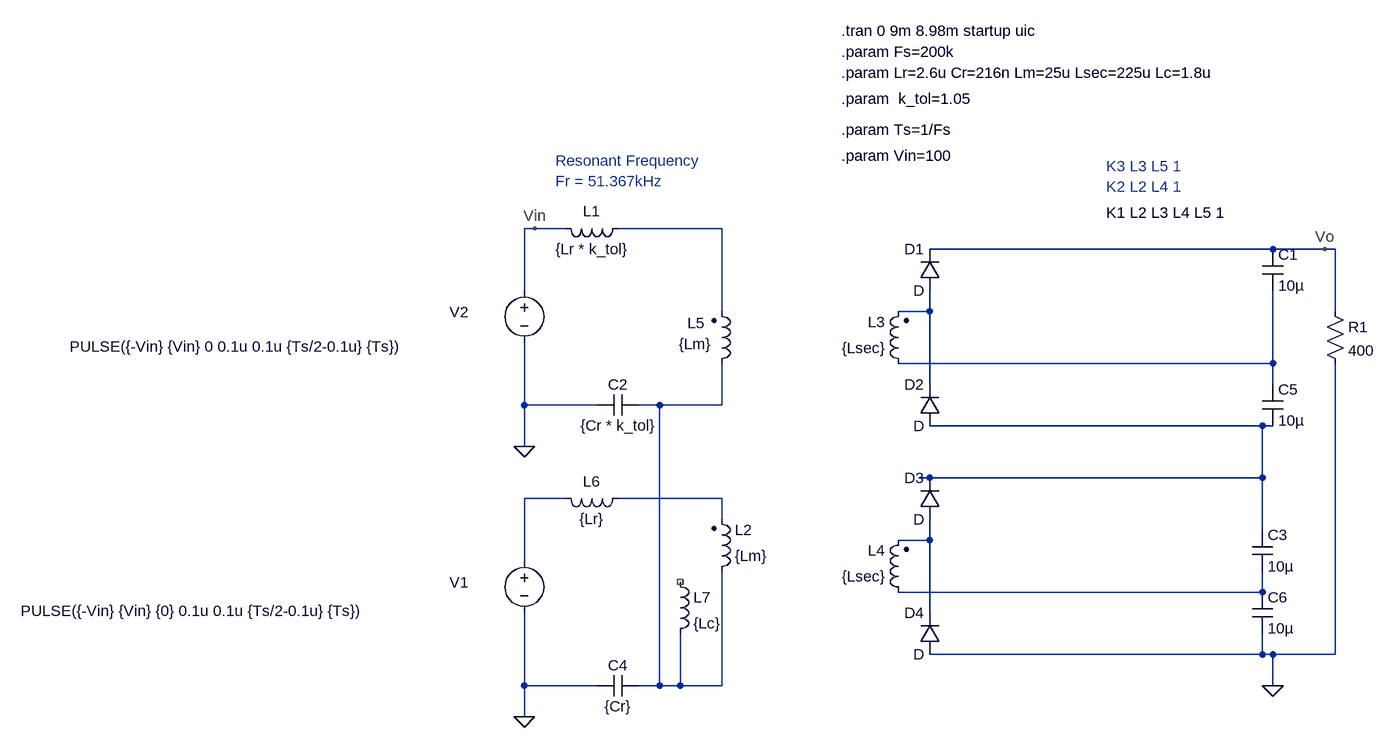
[diagram p0: schematic LLC 2-phase IPOS coupled transformer.asc]
LLC 2-phase IPOS coupled transformer.asc, the LTspice schematic file:
Version 4
SHEET 1 880 1140
WIRE -528 -96 -544 -96
WIRE -480 -96 -528 -96
WIRE -240 -96 -400 -96
WIRE 608 -64 80 -64
WIRE 688 -64 608 -64
WIRE 704 -64 688 -64
WIRE -544 0 -544 -96
WIRE -240 32 -240 -96
WIRE 80 32 80 0
WIRE 80 32 32 32
WIRE 704 32 704 -64
WIRE 608 112 608 0
WIRE 608 112 32 112
WIRE 80 144 80 32
WIRE 608 144 608 112
WIRE -544 176 -544 80
WIRE -432 176 -544 176
WIRE -336 176 -368 176
WIRE -240 176 -240 112
WIRE -240 176 -336 176
WIRE 592 208 80 208
WIRE 608 208 592 208
WIRE -544 240 -544 176
WIRE 80 288 64 288
WIRE 592 288 592 208
WIRE 592 288 80 288
WIRE -480 320 -544 320
WIRE -240 320 -400 320
WIRE -240 352 -240 320
WIRE 592 368 592 288
WIRE 80 384 80 352
WIRE 80 384 32 384
WIRE -544 416 -544 320
WIRE 592 464 592 432
WIRE 592 464 32 464
WIRE 80 496 80 384
WIRE 592 560 592 528
WIRE 592 560 80 560
WIRE 608 560 592 560
WIRE 704 560 704 112
WIRE 704 560 608 560
WIRE -544 608 -544 496
WIRE -432 608 -544 608
WIRE -336 608 -336 176
WIRE -336 608 -368 608
WIRE -304 608 -304 528
WIRE -304 608 -336 608
WIRE -240 608 -240 432
WIRE -240 608 -304 608
WIRE 608 608 608 560
WIRE -544 656 -544 608
FLAG 608 608 0
FLAG 688 -64 Vo
FLAG -544 240 0
FLAG -528 -96 Vin
FLAG -544 656 0
SYMBOL ind -496 -112 M90
WINDOW 0 5 56 VBottom 2
WINDOW 3 32 56 VTop 2
SYMATTR InstName L1
SYMATTR Value {Lr * k_tol}
SYMBOL ind2 -256 448 M180
WINDOW 0 36 80 Left 2
WINDOW 3 36 40 Left 2
SYMATTR InstName L2
SYMATTR Value {Lm}
SYMATTR Type ind
SYMBOL ind2 48 128 R180
WINDOW 0 36 80 Left 2
WINDOW 3 36 40 Left 2
SYMATTR InstName L3
SYMATTR Value {Lsec}
SYMATTR Type ind
SYMBOL diode 96 0 R180
WINDOW 0 24 64 Left 2
WINDOW 3 24 0 Left 2
SYMATTR InstName D1
SYMBOL res 688 16 R0
SYMATTR InstName R1
SYMATTR Value 400
SYMBOL diode 96 208 R180
WINDOW 0 24 64 Left 2
WINDOW 3 24 0 Left 2
SYMATTR InstName D2
SYMBOL cap -432 192 R270
WINDOW 0 32 32 VTop 2
WINDOW 3 0 32 VBottom 2
SYMATTR InstName C2
SYMATTR Value {Cr * k_tol}
SYMBOL cap 576 368 R0
SYMATTR InstName C3
SYMATTR Value 10µ
SYMBOL diode 96 352 R180
WINDOW 0 24 64 Left 2
WINDOW 3 24 0 Left 2
SYMATTR InstName D3
SYMBOL diode 96 560 R180
WINDOW 0 24 64 Left 2
WINDOW 3 24 0 Left 2
SYMATTR InstName D4
SYMBOL ind2 48 480 R180
WINDOW 0 36 80 Left 2
WINDOW 3 36 40 Left 2
SYMATTR InstName L4
SYMATTR Value {Lsec}
SYMATTR Type ind
SYMBOL ind2 -256 128 M180
WINDOW 0 -37 78 Left 2
WINDOW 3 -50 46 Left 2
SYMATTR InstName L5
SYMATTR Value {Lm}
SYMATTR Type ind
SYMBOL cap -432 624 R270
WINDOW 0 32 32 VTop 2
WINDOW 3 0 32 VBottom 2
SYMATTR InstName C4
SYMATTR Value {Cr}
SYMBOL voltage -544 -16 R0
WINDOW 123 0 0 Left 0
WINDOW 39 0 0 Left 0
WINDOW 3 -700 102 Left 2
WINDOW 0 -115 49 Left 2
SYMATTR Value PULSE({-Vin} {Vin} 0 0.1u 0.1u {Ts/2-0.1u} {Ts})
SYMATTR InstName V2
SYMBOL voltage -544 400 R0
WINDOW 123 0 0 Left 0
WINDOW 39 0 0 Left 0
WINDOW 3 -775 93 Left 2
WINDOW 0 -115 49 Left 2
SYMATTR Value PULSE({-Vin} {Vin} {0} 0.1u 0.1u {Ts/2-0.1u} {Ts})
SYMATTR InstName V1
SYMBOL ind -496 304 M90
WINDOW 0 5 56 VBottom 2
WINDOW 3 32 56 VTop 2
SYMATTR InstName L6
SYMATTR Value {Lr}
SYMBOL cap 592 -64 R0
SYMATTR InstName C1
SYMATTR Value 10µ
SYMBOL cap 592 144 R0
SYMATTR InstName C5
SYMATTR Value 10µ
SYMBOL cap 576 464 R0
SYMATTR InstName C6
SYMATTR Value 10µ
SYMBOL ind -320 432 R0
SYMATTR InstName L7
SYMATTR Value {Lc}
TEXT 352 -120 Left 2 !K1 L2 L3 L4 L5 1
TEXT 352 -160 Left 2 ;K2 L2 L4 1
TEXT -56 -400 Left 2 !.tran 0 9m 8.98m startup uic
TEXT -56 -368 Left 2 !.param Fs=200k
TEXT -56 -248 Left 2 !.param Ts=1/Fs
TEXT -56 -208 Left 2 !.param Vin=100
TEXT -496 -200 Left 2 ;Resonant Frequency\nFr = 51.367kHz
TEXT 352 -192 Left 2 ;K3 L3 L5 1
TEXT -56 -336 Left 2 !.param Lr=2.6u Cr=216n Lm=25u Lsec=225u Lc=1.8u
TEXT -56 -296 Left 2 !.param  k_tol=1.05

The netlist it stands for:
* LLC 2-phase IPOS coupled transformer.asc
L1 Vin N001 {Lr * k_tol}
L2 N004 N007 {Lm}
L3 N003 N002 {Lsec}
D1 N002 Vo D
R1 Vo 0 400
D2 N005 N002 D
C2 0 N004 {Cr * k_tol}
C3 N005 N009 10µ
D3 N008 N005 D
D4 0 N008 D
L4 N009 N008 {Lsec}
L5 N004 N001 {Lm}
C4 0 N004 {Cr}
V2 Vin 0 PULSE({-Vin} {Vin} 0 0.1u 0.1u {Ts/2-0.1u} {Ts})
V1 N006 0 PULSE({-Vin} {Vin} {0} 0.1u 0.1u {Ts/2-0.1u} {Ts})
L6 N006 N007 {Lr}
C1 Vo N003 10µ
C5 N003 N005 10µ
C6 N009 0 10µ
L7 NC_01 N004 {Lc}
.model D D
.lib standard.dio
K1 L2 L3 L4 L5 1
* K2 L2 L4 1
.tran 0 9m 8.98m startup uic
.param Fs=200k
.param Ts=1/Fs
.param Vin=100
* Resonant Frequency
* Fr = 51.367kHz
* K3 L3 L5 1
.param Lr=2.6u Cr=216n Lm=25u Lsec=225u Lc=1.8u
.param  k_tol=1.05
.backanno
.end